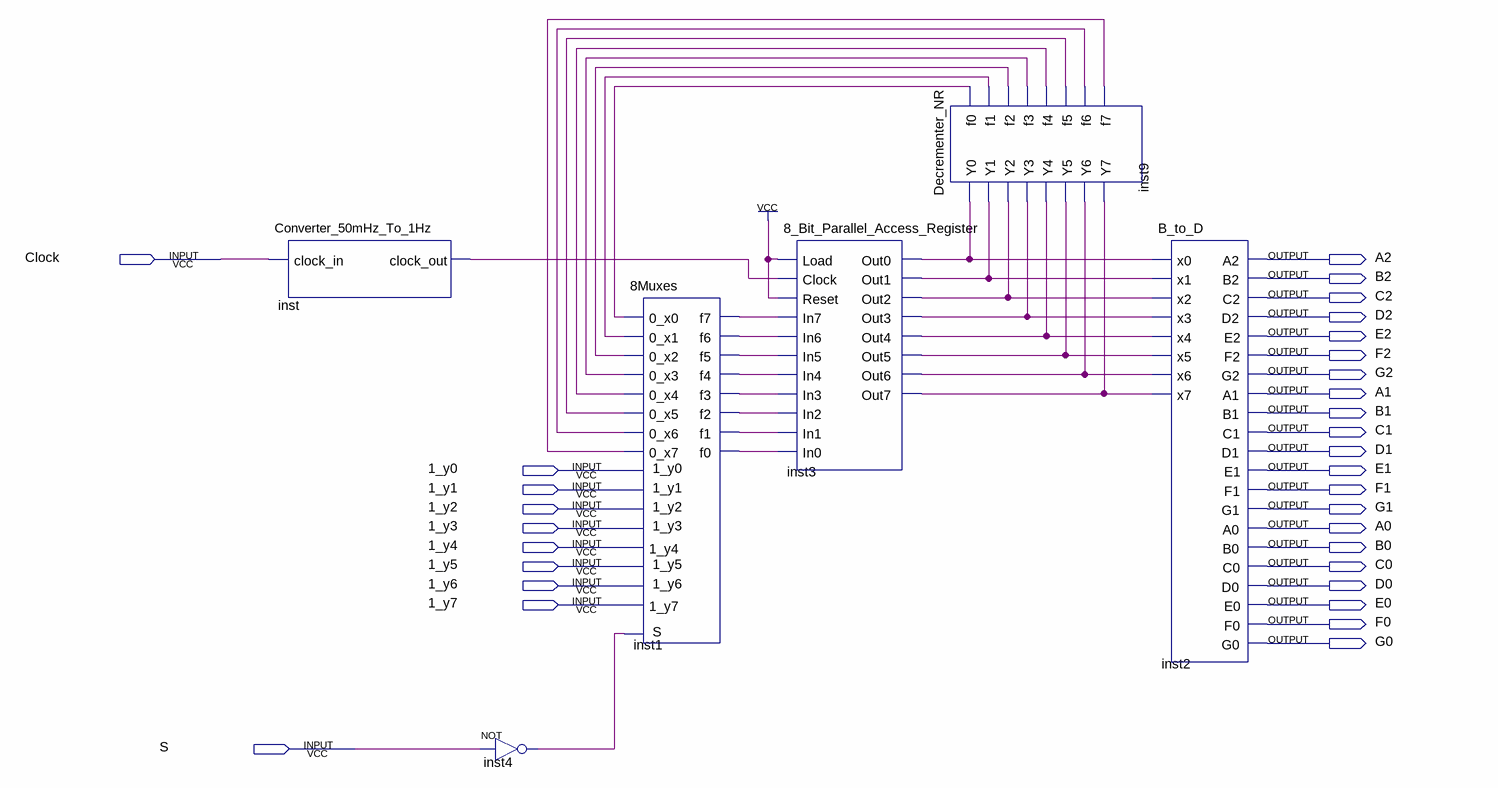
[diagram p0: schematic sheet]
// Quartus schematic TestingDecrementer.bdf as structural Verilog: 6 symbols, 31 pins
module TestingDecrementer (
  input  Clock,
  input  \1_y0 ,
  input  \1_y1 ,
  input  \1_y2 ,
  input  \1_y3 ,
  input  \1_y4 ,
  input  \1_y5 ,
  input  \1_y6 ,
  input  \1_y7 ,
  input  S,
  output A2,
  output B2,
  output C2,
  output D2,
  output E2,
  output F2,
  output G2,
  output A1,
  output B1,
  output C1,
  output D1,
  output E1,
  output F1,
  output G1,
  output A0,
  output B0,
  output C0,
  output D0,
  output E0,
  output F0,
  output G0
);

  wire inst1_f0, inst1_f1, inst1_f2, inst1_f3, inst1_f4, inst1_f5, inst1_f6, inst1_f7, inst3_out0,
       inst3_out1, inst3_out2, inst3_out3, inst3_out4, inst3_out5, inst3_out6, inst3_out7, inst4_out,
       inst9_f0, inst9_f1, inst9_f2, inst9_f3, inst9_f4, inst9_f5, inst9_f6, inst9_f7, inst_clock_out;

  Converter_50mHz_To_1Hz inst (.clock_in(Clock), .clock_out(inst_clock_out));
  not inst4 (inst4_out, S);
  \8Muxes  inst1 (
    .\0_x0 (inst9_f0), .\1_y0 (\1_y0 ), .\0_x1 (inst9_f1), .\1_y1 (\1_y1 ), .\0_x2 (inst9_f2),
    .\1_y2 (\1_y2 ), .\0_x3 (inst9_f3), .\1_y3 (\1_y3 ), .\0_x4 (inst9_f4), .\1_y4 (\1_y4 ),
    .\0_x5 (inst9_f5), .\1_y5 (\1_y5 ), .\0_x6 (inst9_f6), .\1_y6 (\1_y6 ), .\0_x7 (inst9_f7), .S(inst4_out),
    .\1_y7 (\1_y7 ), .f0(inst1_f0), .f1(inst1_f1), .f2(inst1_f2), .f3(inst1_f3), .f4(inst1_f4),
    .f5(inst1_f5), .f6(inst1_f6), .f7(inst1_f7));
  \8_Bit_Parallel_Access_Register  inst3 (
    .Load(1'b1), .Clock(inst_clock_out), .Reset(1'b1), .In7(inst1_f7), .In6(inst1_f6), .In5(inst1_f5),
    .In4(inst1_f4), .In3(inst1_f3), .In2(inst1_f2), .In1(inst1_f1), .In0(inst1_f0), .Out7(inst3_out7),
    .Out6(inst3_out6), .Out5(inst3_out5), .Out4(inst3_out4), .Out2(inst3_out2), .Out1(inst3_out1),
    .Out0(inst3_out0), .Out3(inst3_out3));
  Decrementer_NR inst9 (
    .Y0(inst3_out0), .Y1(inst3_out1), .Y2(inst3_out2), .Y3(inst3_out3), .Y4(inst3_out4), .Y5(inst3_out5),
    .Y6(inst3_out6), .Y7(inst3_out7), .f0(inst9_f0), .f1(inst9_f1), .f2(inst9_f2), .f3(inst9_f3),
    .f4(inst9_f4), .f5(inst9_f5), .f6(inst9_f6), .f7(inst9_f7));
  B_to_D inst2 (
    .x0(inst3_out0), .x1(inst3_out1), .x2(inst3_out2), .x3(inst3_out3), .x4(inst3_out4), .x5(inst3_out5),
    .x6(inst3_out6), .x7(inst3_out7), .A2(A2), .B2(B2), .C2(C2), .D2(D2), .E2(E2), .F2(F2), .G2(G2), .A1(A1),
    .B1(B1), .C1(C1), .D1(D1), .E1(E1), .F1(F1), .G1(G1), .A0(A0), .B0(B0), .C0(C0), .D0(D0), .E0(E0),
    .F0(F0), .G0(G0));
endmodule
